# EAGLE design Pi-Go (EAGLE 7.3.0)
13.8V power adapter for RPi
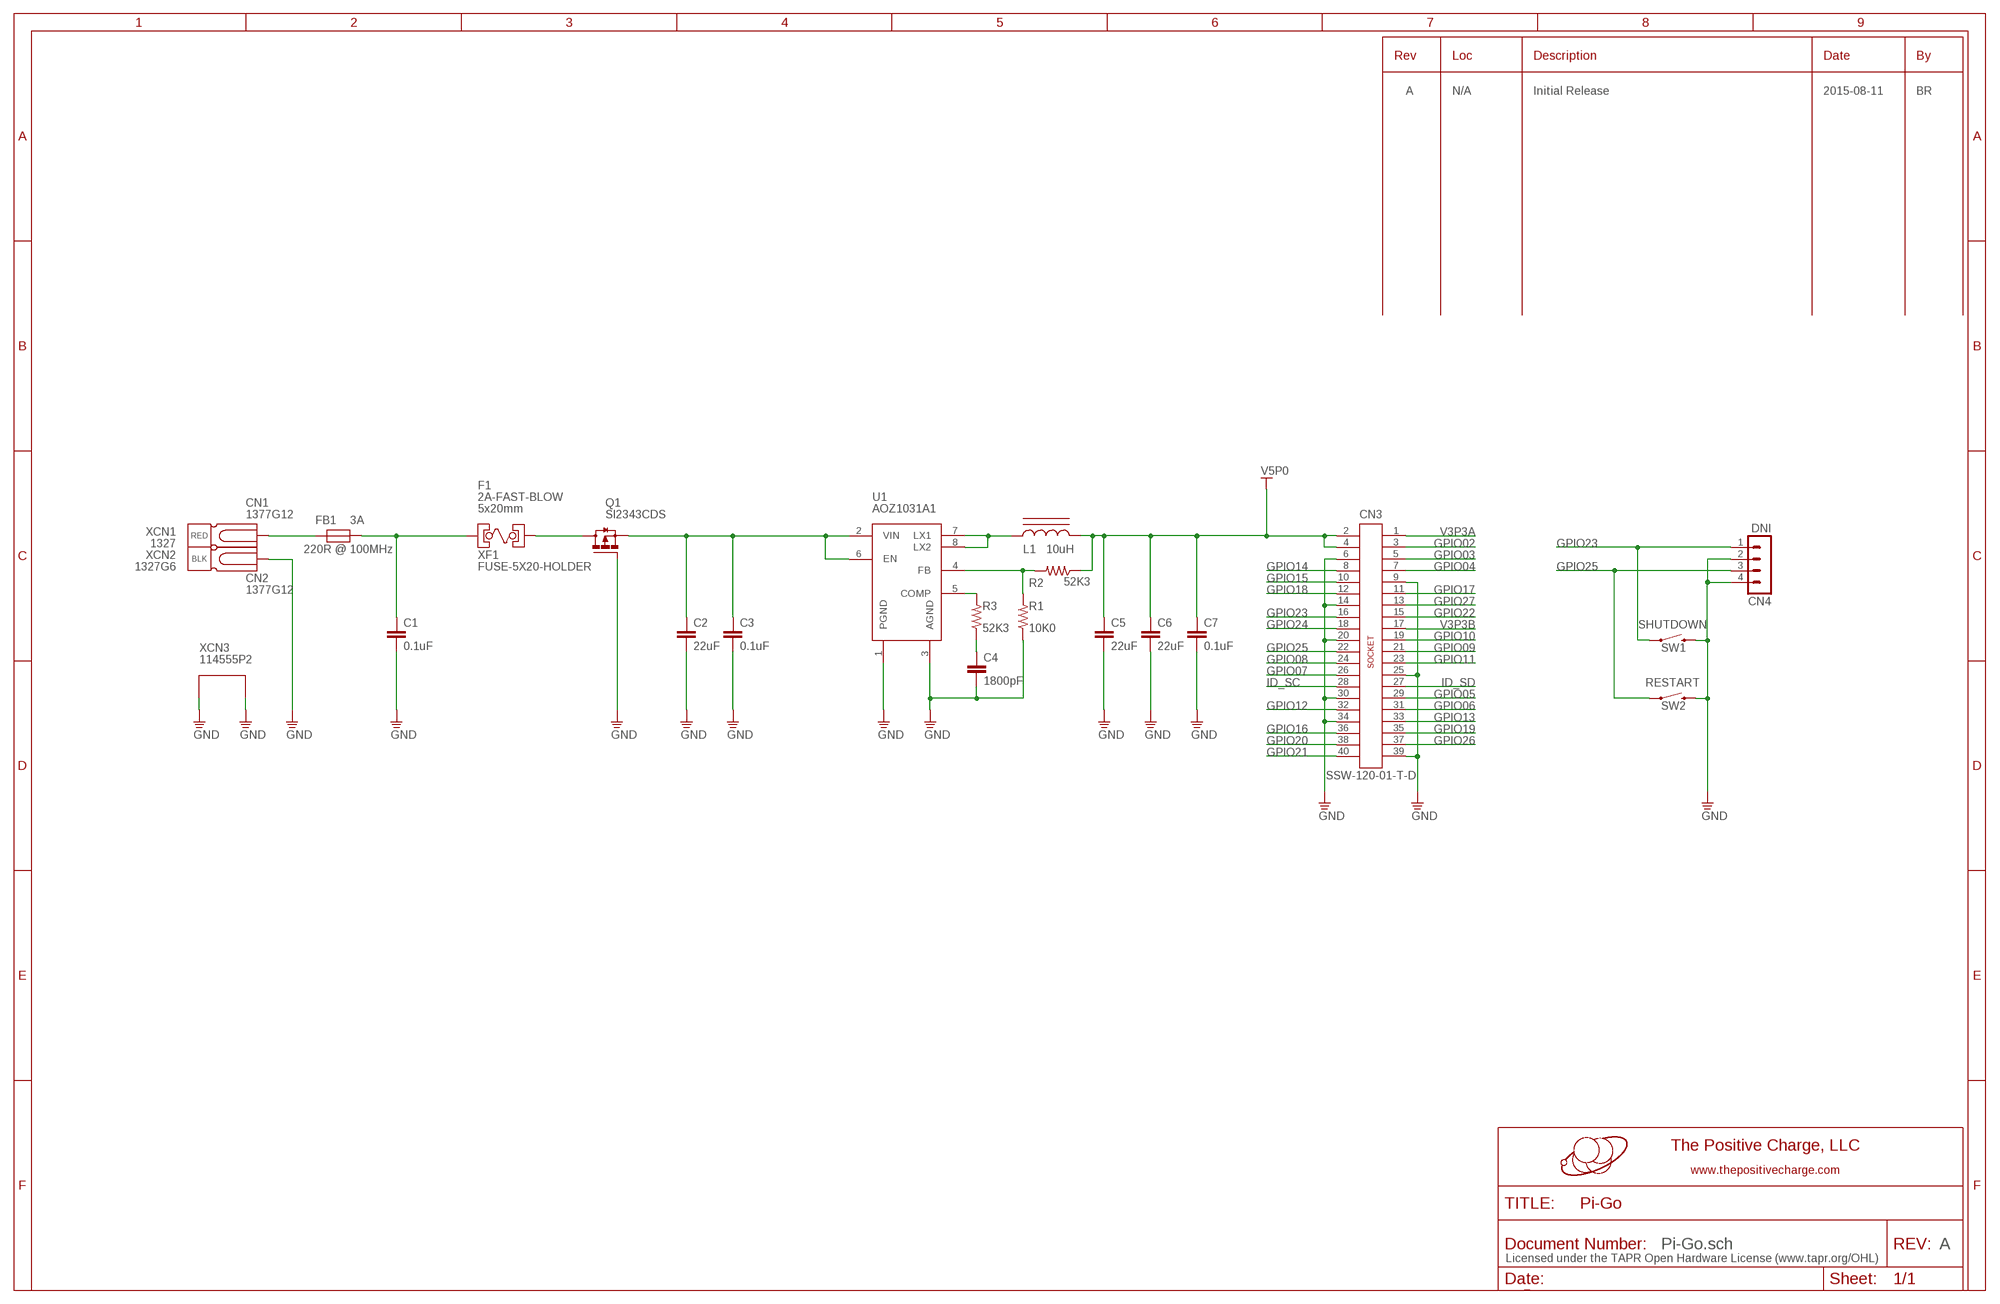
[diagram p0: schematic, sheet 1]

## Parts
C1  0.1uF  C-EUC0805  [C0805]
C2  22uF  C-EUC1210  [C1210]
C3  0.1uF  C-EUC0805  [C0805]
C4  1800pF  C-EUC0805  [C0805]
C5  22uF  C-EUC1210  [C1210]
C6  22uF  C-EUC1210  [C1210]
C7  0.1uF  C-EUC0805  [C0805]
CN1  1377G12  [1377G12]
CN2  1377G12  [1377G12]
CN3  SSW-120-01-T-D  [SSW-120-XX-X-D]
CN4  DNI  MA04-1  [MA04-1]
FB1  3A  FB0805  [C0805]
L1  10uH  SRP1265A  [POWER-INDUCTOR-SHIELD]
Q1  SI2343CDS  [SOT23]
R1  10K0  R-US_R0805  [R0805]
R2  52K3  R-US_R0805  [R0805]
R3  52K3  R-US_R0805  [R0805]
SW1  SWITCH-MOMENTARY-2SMD-4  [TACTILE_SWITCH_TALL]
SW2  SWITCH-MOMENTARY-2SMD-4  [TACTILE_SWITCH_TALL]
U1  AOZ1031A1  [AOZ1031AI-SO08]
XCN3  114555P2  [APP2X1CLIP]
XF1  FUSE-5X20-HOLDER  [LITTELFUSE-02540101Z]

## Nets
COM2: C4.1 R3.1
COMP1: R3.2 U1.5(COMP)
FB: R1.2 R2.2 U1.4(FB)
FUSED: Q1.3(D) XF1.2
GND: C1.2 C2.2 C3.2 C4.2 C5.2 C6.2 C7.2 CN2.P$1 CN3.6 CN3.9 CN3.14 CN3.20 CN3.25 CN3.30 CN3.34 CN3.39 CN4.2 CN4.4 Q1.1(G) R1.1 SW1.B1 SW1.B2 SW2.B1 SW2.B2 U1.1(PGND) U1.3(AGND) XCN3.P$1 XCN3.P$2
GPIO02: CN3.3
GPIO03: CN3.5
GPIO04: CN3.7
GPIO05: CN3.29
GPIO06: CN3.31
GPIO07: CN3.26
GPIO08: CN3.24
GPIO09: CN3.21
GPIO10: CN3.19
GPIO11: CN3.23
GPIO12: CN3.32
GPIO13: CN3.33
GPIO14: CN3.8
GPIO15: CN3.10
GPIO16: CN3.36
GPIO17: CN3.11
GPIO18: CN3.12
GPIO19: CN3.35
GPIO20: CN3.38
GPIO21: CN3.40
GPIO22: CN3.15
GPIO23: CN3.16 CN4.1 SW1.A1 SW1.A2
GPIO24: CN3.18
GPIO25: CN3.22 CN4.3 SW2.A1 SW2.A2
GPIO26: CN3.37
GPIO27: CN3.13
ID_SC: CN3.28
ID_SD: CN3.27
LX: L1.1 U1.7(LX1) U1.8(LX2)
N$1: CN1.P$1 FB1.1
V3P3A: CN3.1
V3P3B: CN3.17
V5P0: C5.1 C6.1 C7.1 CN3.2 CN3.4 L1.2 R2.1
VIN: C2.1 C3.1 Q1.2(S) U1.2(VIN) U1.6(EN)
VINFLT: C1.1 FB1.2 XF1.1

## Notes on the sheet
- A | N/A | Initial Release | 2015-08-11 | BR
- 5x20mm
- RED
- 220R @ 100MHz
- BLK
- SHUTDOWN
- RESTART
- Pi-Go.sch | A
- Licensed under the TAPR Open Hardware License (www.tapr.org/OHL)

## Library data of the parts
C1-C7 = resistor:C-EU: CAPACITOR, European symbol
CN1 CN2 = tpc:1377G12: Anderson Powerpole 25A Pin Right Angle Bottom Low Force
CN3 = tpc:SSW-120-01-T-D: THROUGH-HOLE .025" SQ POST SOCKET Source: Samtec SSW.pdf
CN4 = tpc:MA04-1: PIN HEADER; OC_FARNELL: unknown; OC_NEWARK: unknown
FB1 = tpc:FB: Ferrite Bead
L1 = tpc:SRP1265A
Q1 = tpc:SI2343CDS: Single P-Channel, MOSFET
R1-R3 = rcl:R-US_: RESISTOR, American symbol
SW1 SW2 = SparkFun-Electromechanical:SWITCH-MOMENTARY-2: Various NO switches- pushbuttons, reed, etc; PROD_ID: SWCH-11966
U1 = tpc:AOZ1031A1: EZBuck 3A Synchronous Buck Regulator
XCN3 = tpc:114555P2: Anderson Powerpole Mounting Staple 2x1
XF1 = tpc:FUSE-5X20-HOLDER: 5x20mm Fuse Holder

## Board
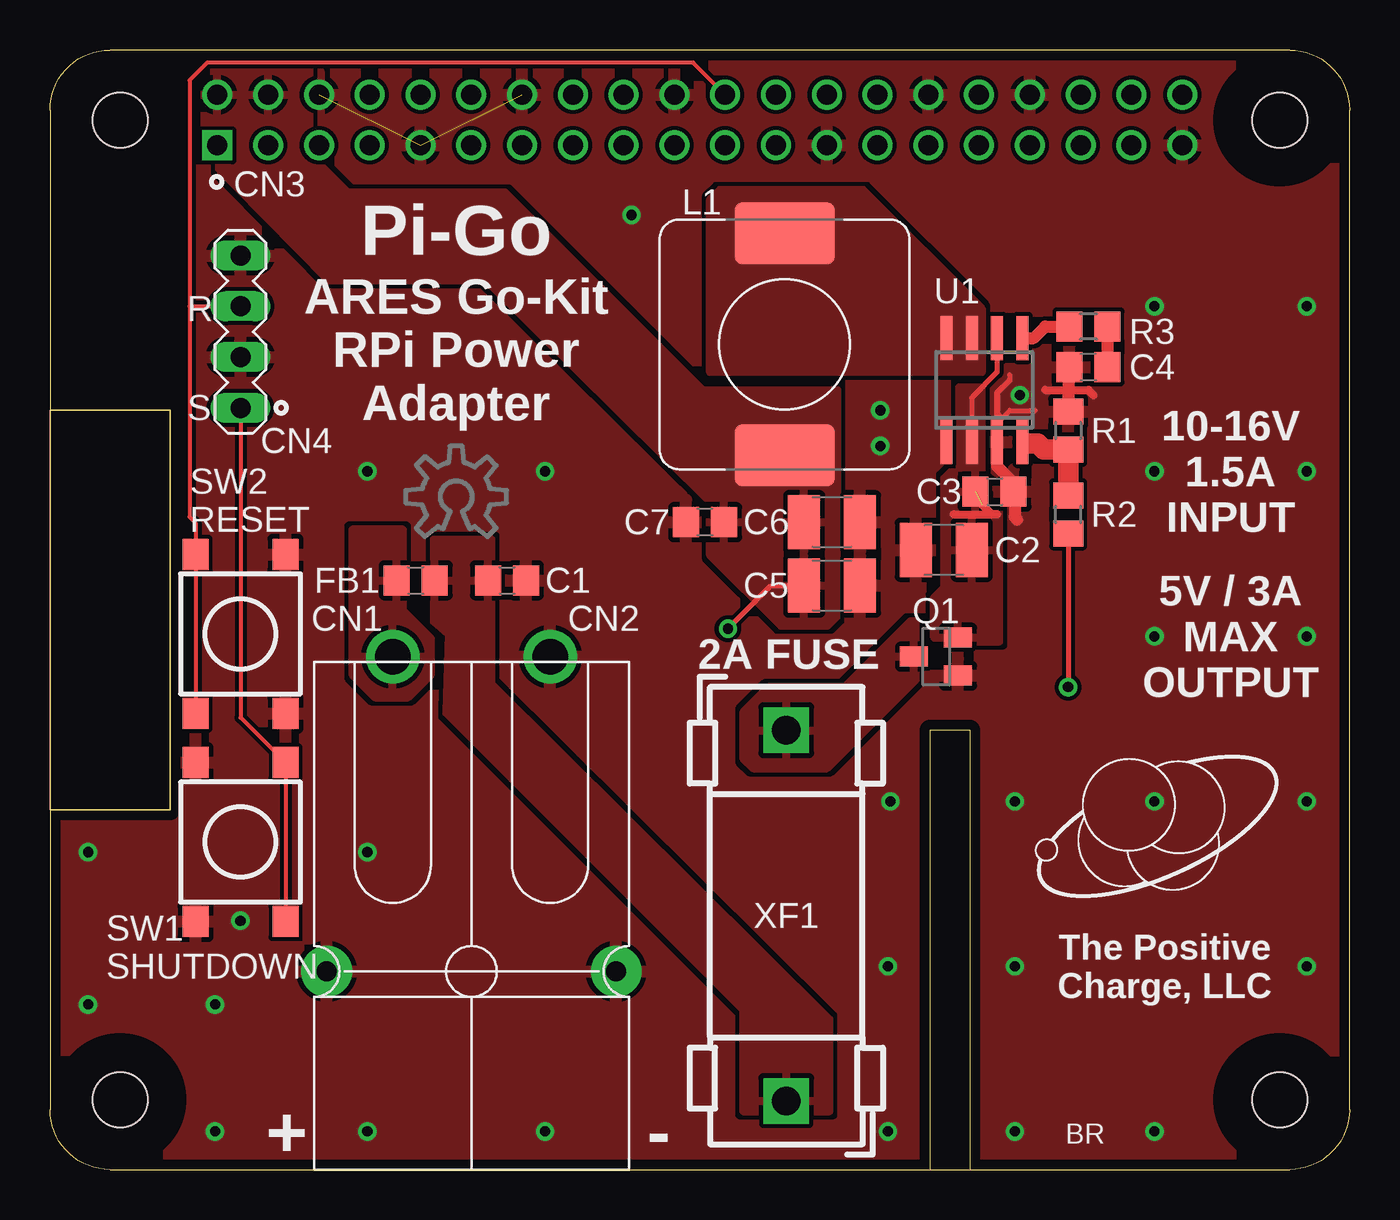
[diagram p1: board, top side]
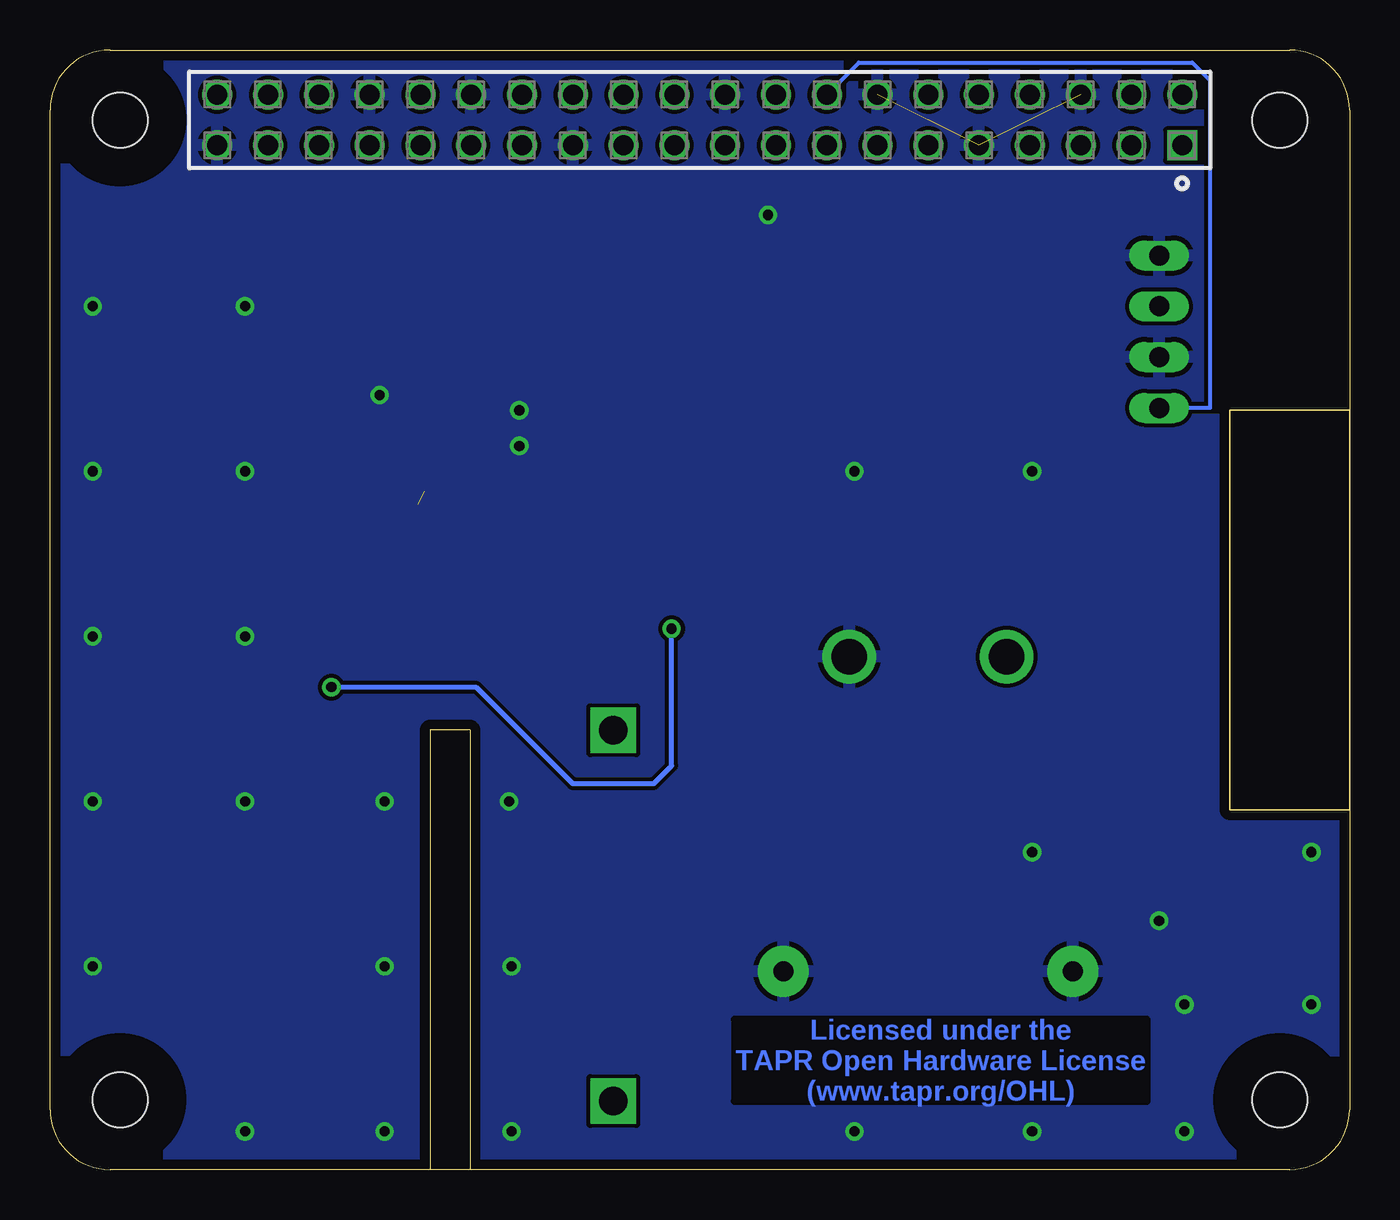
[diagram p2: board, bottom side, seen from below]

Size 65 x 56 mm. Coordinates in mm from the lower left corner, seen from the top.
Outline: 0,38 0,53 arc-90 3,56 62,56 arc-90 65,53 65,3 arc-90 62,0 46,0
Outline: 0,38 0,18
Outline: 0,18 0,3 arc90 3,0 44,0
Outline: 0,18 6,18 6,38 0,38
Outline: 44,0 44,22 46,22 46,0
Outline: 44,0 46,0
Copper layers (1*16): Top 0.0178mm / dielectric 59mil / Bottom 0.0178mm
Design rules "Pi-Go *": minimum track width 8mil, minimum drill 14mil, track to track 8mil, track to pad 8mil, pad to pad 8mil, via to via 8mil, smd to smd 6mil, copper to edge 20mil, drill to drill 16mil, minimum pad ring 8mil, minimum via ring 8mil, stop-mask expansion 3mil, vias tented up to drill 0mil, thermal gap 10mil
Holes 2.75 mm at 3.5,52.5 61.5,52.5 61.5,3.5 3.5,3.5
tRestrict: area 0.4,0.4 to 6.6,6.6; area 58.4,0.4 to 64.6,6.6; area 58.4,49.4 to 64.6,55.6; area 0.4,49.4 to 6.6,55.6
bRestrict: area 0.4,49.4 to 6.6,55.6; area 58.4,49.4 to 64.6,55.6; area 58.4,0.4 to 64.6,6.6; area 0.4,0.4 to 6.6,6.6
Milling: 7 lines

### Footprints (pad centres in the part's own frame; a part is rotated, then mirrored left to right if it is on the bottom)
C0805 = smd 1.3 x 1.5: 1 -0.95,0; 2 0.95,0
C1210 = smd 1.6 x 2.7: 1 -1.4,0; 2 1.4,0
1377G12 = drill 1.778: P$1 25.654,0
SSW-120-XX-X-D = drill 1 pad 1.5 square: 1 24.13,-1.27 | drill 1 pad 1.5: 2 24.13,1.27; 3 21.59,-1.27; 4 21.59,1.27; 5 19.05,-1.27; 6 19.05,1.27; 7 16.51,-1.27; 8 16.51,1.27; 9 13.97,-1.27; 10 13.97,1.27; 11 11.43,-1.27; 12 11.43,1.27; 13 8.89,-1.27; 14 8.89,1.27; 15 6.35,-1.27; 16 6.35,1.27; 17 3.81,-1.27; 18 3.81,1.27; 19 1.27,-1.27; 20 1.27,1.27; 21 -1.27,-1.27; 22 -1.27,1.27; 23 -3.81,-1.27; 24 -3.81,1.27; 25 -6.35,-1.27; 26 -6.35,1.27; 27 -8.89,-1.27; 28 -8.89,1.27; 29 -11.43,-1.27; 30 -11.43,1.27; 31 -13.97,-1.27; 32 -13.97,1.27; 33 -16.51,-1.27; 34 -16.51,1.27; 35 -19.05,-1.27; 36 -19.05,1.27; 37 -21.59,-1.27; 38 -21.59,1.27; 39 -24.13,-1.27; 40 -24.13,1.27
MA04-1 = drill 1 long: 1 -3.81,0; 2 -1.27,0; 3 1.27,0; 4 3.81,0
POWER-INDUCTOR-SHIELD = smd 5 x 3.1: 1 0,5.55; 2 0,-5.55
SOT23 = smd 1 x 1.4: 1 -0.95,-1.1; 2 0.95,-1.1; 3 0,1.1
R0805 = smd 1.3 x 1.5: 1 -0.95,0; 2 0.95,0
TACTILE_SWITCH_TALL = smd 1.55 x 1.3: A1 -3.975,-2.25; A2 3.975,-2.25; B1 -3.975,2.25; B2 3.975,2.25
AOZ1031AI-SO08 = smd 0.6 x 2.2: 1 -1.905,-2.6; 2 -0.635,-2.6; 3 0.635,-2.6; 4 1.905,-2.6; 5 1.905,2.6; 6 0.635,2.6; 7 -0.635,2.6; 8 -1.905,2.6
APP2X1CLIP = drill 1 pad 2.54: P$1 7.239,0; P$2 -7.239,0
LITTELFUSE-02540101Z = drill 1.422 pad 2.286 square: 1 -9.271,0; 2 9.271,0

### Placement (x,y rotation side)
C1  22.86,29.46 0 top
C2  44.7,30.99 180 top
C3  47.24,33.91 0 top
C4  51.94,40.13 180 top
C5  39.12,29.21 0 top
C6  39.12,32.38 0 top
C7  32.77,32.38 180 top
CN1  17.14,0 90 top
CN2  25.02,0 90 top
CN3  32.5,52.5 0 bottom
CN4  9.53,41.91 90 top
DRILEGEND  [DRILEGEND]  17.83,-17.75 0 top  (outside the outline)
FB1  18.29,29.46 0 top
L1  36.74,41.27 0 top
Q1  44.32,25.65 90 top
R1  50.93,36.96 270 top
R2  50.93,32.77 90 top
R3  51.94,42.16 180 top
SW1  9.53,16.38 90 top
SW2  9.53,26.8 270 top
U1  46.74,38.99 0 top
U$1  [TPC-LOGO]  49.28,13.59 0 top
U$3  [OSHWLOGO_TOP_0.2]  20.32,33.66 0 top
XCN3  21.08,9.91 0 top
XF1  36.83,12.7 90 top

### Tracks (layer width: path | path; a pad name or v marks a point on that pad's centre or on a via)
COM2
  Top 0.61: R3.1 C4.1
COMP1
  Top 0.61: U1.5 49.21,41.59 49.78,42.16 R3.2
FB
  Top 0.61: U1.4 48.71,36.32 49.02,36.32
  Top 1.016: 49.02,36.32 49.4,36.32 49.72,36.01 R1.2 R2.2
FUSED
  pour Top (rank 2): 34.67,22.86 34.67,20.57 35.18,20.07 38.86,20.07 43.31,24.51 43.31,27.43 43.05,27.43 39.75,24.13 35.94,24.13
GND  (via drill 0.51)  (2 unrouted)
  Top 0.254: 47.37,36.58 47.37,37.34 | 47.37,37.34 48.01,37.97 49.28,37.97 | 48.01,39.75 48.01,39.5 | 47.37,37.34 47.37,37.72 47.5,37.72 | 51.18,39.88 50.93,39.62
  Top 0.305: 48.01,39.5 47.37,38.86 47.37,37.72
  Top 0.406: 49.78,38.99 51.94,38.99 52.2,38.73
  Top 0.61: 48.26,33.91 48.26,32.64 48.39,32.51 | 50.93,39.62 50.93,38.1 | 47.37,36.32 47.37,35.18 48.13,34.42 48.13,34.29
  other vias: 42.04,18.41 48.26,18.41 41.91,10.16 41.91,1.91 48.26,10.16 48.26,1.91 55.24,1.91 62.87,10.16 55.24,18.41 62.87,18.41 62.87,43.18 24.77,1.91 15.88,1.91 8.26,1.91 8.26,8.26 1.91,8.26 1.91,15.88 9.53,12.45 15.88,15.88 15.88,34.92 24.77,34.92 41.53,36.2 48.51,38.73 41.53,37.97 55.24,26.67 62.87,26.67 55.24,34.92 62.87,34.92 55.24,43.18 29.08,47.75
  pour Bottom (rank 6): 0,0 65,0 65,56 0,56
  pour Top (rank 6): 0,0 65,0 65,56 0,56
GPIO23
  Top 0.203: CN4.1 9.53,22.61 SW1.A2 SW1.A1
  Bottom 0.203: CN3.16 24.55,55.37 7.87,55.37 6.99,54.48 6.99,38.1 CN4.1
GPIO25
  Top 0.203: CN3.22 32.17,55.37 7.87,55.37 6.99,54.48 6.99,43.18 | 6.99,43.18 CN4.3 | 6.99,43.18 6.99,32.64 7.28,32.35 SW2.A1 SW2.A2
LX
  pour Top (rank 2): 46.61,39.88 33.02,39.88 33.02,48.51 33.53,49.02 40.64,49.02 46.61,43.05
N$1
  pour Top: 16.26,23.62 17.91,23.62 19.05,24.77 19.05,26.54 17.65,27.94 17.65,32 15.11,32 15.11,24.77
V5P0  (via drill 0.51)
  Top 0.254: R2.1 v50.93,24.13 | v33.91,27.05 36.07,29.21 C5.1
  Bottom 0.254: v50.93,24.13 43.69,24.13 38.86,19.3 34.8,19.3 33.91,20.19 v33.91,27.05
  pour Top: 38.86,27.18 36.58,27.18 33.02,30.73 33.02,33.4 21.84,44.45 13.97,44.45 7.75,50.8 7.75,55.24 7.87,55.37 12.95,55.37 12.95,50.8 14.86,48.9 22.73,48.9 32.64,38.99 39.37,38.99 39.37,27.69
VIN  (1 unrouted)
  Top 0.254: U1.6 47.37,39.88 46.1,38.61 U1.2
  Top 0.406: 45.21,32.77 47.12,32.77 | 47.37,32.77 47.12,32.77 | 47.12,32.77 46.61,33.27
  pour Top (rank 4): 45.47,39.12 45.47,35.31 44.7,34.54 44.7,29.08 44.2,28.57 44.2,26.67 44.45,26.42 47.5,26.42 47.5,32.89 46.61,33.78 46.61,39.12
VINFLT
  pour Top (rank 2): 19.18,31.5 19.18,27.43 19.94,26.8 19.81,22.86 34.67,8 34.67,2.92 38.99,2.92 38.99,7.49 22.1,24.26 22.1,31.5

### Text on the board
Bottom: Licensed under the / TAPR Open Hardware License / (www.tapr.org/OHL)
tNames: Pi-Go | R | S | ARES Go-Kit / RPi Power / Adapter | 10-16V / 1.5A / INPUT | RESET | 5V / 3A / MAX / OUTPUT | 2A FUSE | SHUTDOWN | The Positive / Charge, LLC | + | - | BR
Measures: CORNER RADIUS | AREA FOR / AGENCY MARKS | AREA FOR / AGENCY MARKS
Document: Licensed under the TAPR Open Hardware License (www.tapr.org/OHL)
DrillLegend: LAYER-STACK
DrillLegend_01-16: 01-16
DrillLegend_01-20: 01-20